# Altium schematic sheet PWR.SchDoc
size A4; SheetNumber: 1; SheetTotal: 10
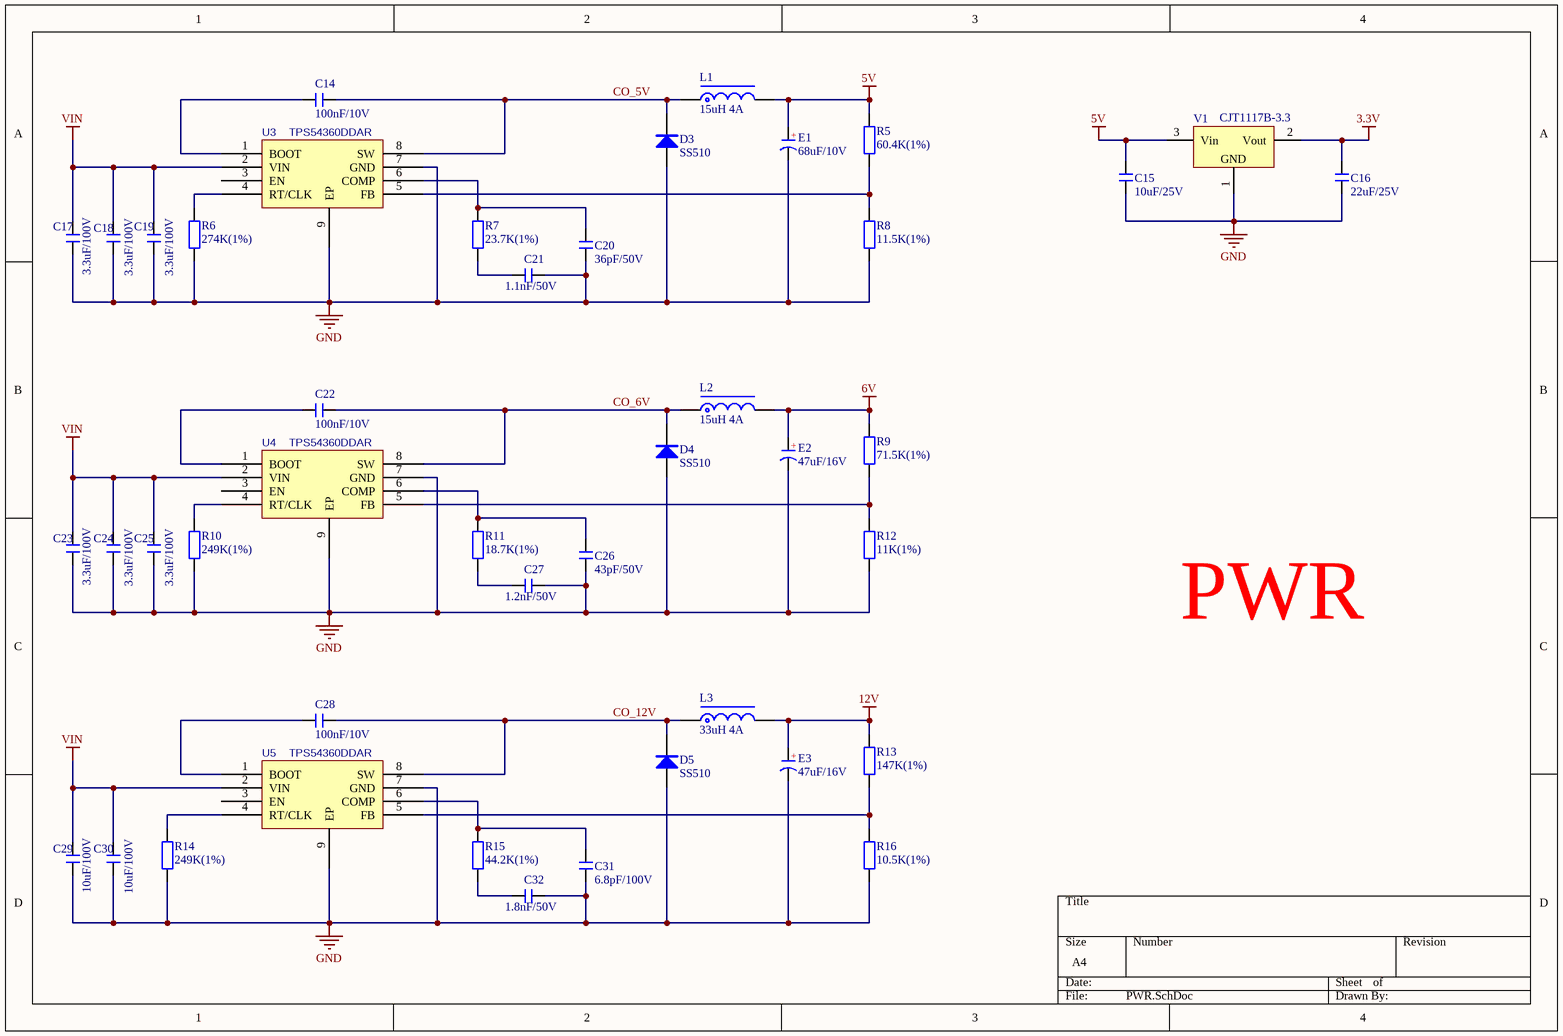
[diagram p0: PWR.SchDoc]

## Parts
C14  100nF/10V  [C 0603_L]
C15  10uF/25V  [C 0603_L]
C16  22uF/25V  [C 0603_L]
C17  3.3uF/100V  [C 1210_L]
C18  3.3uF/100V  [C 1210_L]
C19  3.3uF/100V  [C 1210_L]
C20  36pF/50V  [C 0603_L]
C21  1.1nF/50V  [C 0603_L]
C22  100nF/10V  [C 0603_L]
C23  3.3uF/100V  [C 1210_L]
C24  3.3uF/100V  [C 1210_L]
C25  3.3uF/100V  [C 1210_L]
C26  43pF/50V  [C 0603_L]
C27  1.2nF/50V  [C 0603_L]
C28  100nF/10V  [C 0603_L]
C29  10uF/100V  [C 1210_L]
C30  10uF/100V  [C 1210_L]
C31  6.8pF/100V  [C 0603_L]
C32  1.8nF/50V  [C 0603_L]
D3  SS510  [SMA]
D4  SS510  [SMA]
D5  SS510  [SMA]
E1  68uF/10V  [CD B(3528)]
E2  47uF/16V  [CD B(3528)]
E3  47uF/16V  [CD B(3528)]
L1  15uH 4A  [L-SMD-1040]
L2  15uH 4A  [L-SMD-1040]
L3  33uH 4A  [L-SMD-1040]
R5  60.4K(1%)  [R 0603_L]
R6  274K(1%)  [R 0603_L]
R7  23.7K(1%)  [R 0603_L]
R8  11.5K(1%)  [R 0603_L]
R9  71.5K(1%)  [R 0603_L]
R10  249K(1%)  [R 0603_L]
R11  18.7K(1%)  [R 0603_L]
R12  11K(1%)  [R 0603_L]
R13  147K(1%)  [R 0603_L]
R14  249K(1%)  [R 0603_L]
R15  44.2K(1%)  [R 0603_L]
R16  10.5K(1%)  [R 0603_L]
U3  TPS54360DDAR  [SOP-8EP]
U4  TPS54360DDAR  [SOP-8EP]
U5  TPS54360DDAR  [SOP-8EP]
V1  CJT1117B-3.3  [SOT223_L]

## Nets
3.3V: C16.2 V1.2(Vout)
5V: C15.2 E1.1(A) L1.2 R5.2 V1.3(Vin)
6V: E2.1(A) L2.2 R9.2
12V: E3.1(A) L3.2 R13.2
GND: C15.1 C16.1 C17.1 C18.1 C19.1 C20.2 C21.2 C23.1 C24.1 C25.1 C26.2 C27.2 C29.1 C30.1 C31.2 C32.2 D3.1(A) D4.1(A) D5.1(A) E1.2(K) E2.2(K) E3.2(K) R6.1 R8.1 R10.1 R12.1 R14.1 R16.1 U3.7(GND) U3.9(EP) U4.7(GND) U4.9(EP) U5.7(GND) U5.9(EP) V1.1(GND)
VIN: C17.2 C18.2 C19.2 C23.2 C24.2 C25.2 C29.2 C30.2 U3.2(VIN) U4.2(VIN) U5.2(VIN)
CO_5V: C14.1 D3.2(K) L1.1 U3.8(SW)
CO_6V: C22.1 D4.2(K) L2.1 U4.8(SW)
CO_12V: C28.1 D5.2(K) L3.1 U5.8(SW)
NetC14_2: C14.2 U3.1(BOOT)
NetC20_1: C20.1 R7.2 U3.6(COMP)
NetC21_1: C21.1 R7.1
NetC22_2: C22.2 U4.1(BOOT)
NetC26_1: C26.1 R11.2 U4.6(COMP)
NetC27_1: C27.1 R11.1
NetC28_2: C28.2 U5.1(BOOT)
NetC31_1: C31.1 R15.2 U5.6(COMP)
NetC32_1: C32.1 R15.1
NetR5_1: R5.1 R8.2 U3.5(FB)
NetR6_2: R6.2 U3.4(RT/CLK)
NetR9_1: R9.1 R12.2 U4.5(FB)
NetR10_2: R10.2 U4.4(RT/CLK)
NetR13_1: R13.1 R16.2 U5.5(FB)
NetR14_2: R14.2 U5.4(RT/CLK)

Not connected (* = marked no-connect by the designer): U3 3(EN); U4 3(EN); U5 3(EN)

## Notes on the sheet
- PWR
- (in symbol C-CD) +

## Library data of the parts
C14-C32 = C: 无极性贴片电容; 版权归属: 源创客; BOM名称: 无极性贴片电容; 学习资源: www.ooocke.com
D3-D5 = SS210: 肖特基二极管; 版权归属: 源创客; BOM名称: 肖特基二极管; 学习资源: www.ooocke.com
E1-E3 = C-CD: 贴片钽电容; 版权归属: 源创客; BOM名称: 贴片钽电容; 学习资源: www.ooocke.com
L1-L3 = L-CDRH: 一体成型电感; BOM名称: 功率屏蔽电感; 版权归属: 源创客; 学习资源: www.ooocke.com
R5-R16 = R: 贴片电阻; 版权归属: 源创客; BOM名称: 贴片电阻; 学习资源: www.ooocke.com
U3-U5 = TPS54360DDAR: BOM_Manufacturer: TI; BOM_Supplier: LCSC; BOM_Manufacturer Part: TPS54360DDAR; BOM_Supplier Part: C44377; BOM_JLCPCB Part Class: Extended Part; spicePre: U; spiceSymbolName: TPS54360DDAR
V1 = AMS1117: 三端稳压芯片; BOM名称: 稳压芯片; 版权归属: 源创客; 学习资源: www.ooocke.com